# EAGLE design WaterProbe_TopConnector (EAGLE 9.1.3)
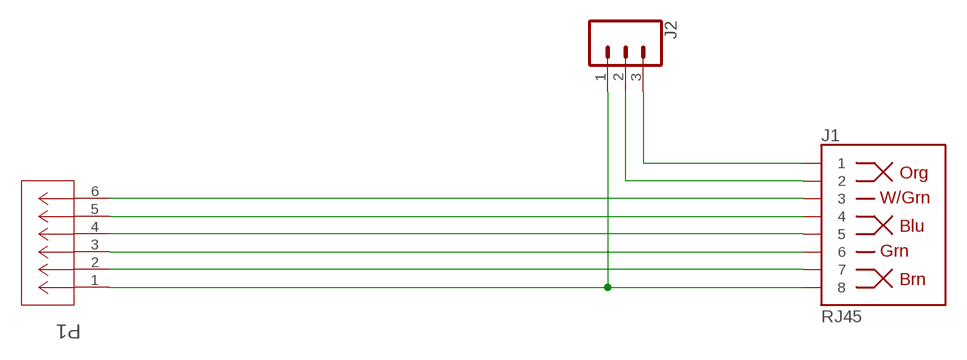
[diagram p0: schematic, sheet 1]

## Parts
J1  RJ45  RJ45-8  [RJ45-8]
J2  CONN_03  [1X03]
P1  6PINJSTS6B-ZR(LF)(SN)  [S6B-ZR]

## Nets
N$1: J1.8 J2.1 P1.1
N$2: J1.7 P1.2
N$3: J1.6 P1.3
N$4: J1.5 P1.4
N$5: J1.4 P1.5
N$6: J1.3 P1.6
N$7: J1.1 J2.3
N$8: J1.2 J2.2

## Library data of the parts
J1 = SparkFun-Connectors:RJ45-8: RJ45 Jack - 8 pin Simple RJ45, 8-pin connection. Commonly used for Cat5, Cat5e, and Cat6 Ethernet cables. Here is the connector we sell at SparkFun: RJ45 8-Pin Connector <https://www.sparkfun.com/products/643> (PRT-00643) Datasheet <https://cdn.sparkfun.com/datasheets/Prototyping/04908.pdf> It is used on this SparkFun product: SparkFun RJ45 Breakout <https://www.sparkfun.com/products/716> (BOB-00716) Note, you may also be interested in the "MAGJACK" version of this. It is basically a RJ45 connector, but also has some status LEDs built into the connector housing. You can check that out in this library at the device named "MAGJACK.dev" and see these products online: RJ45 Ethernet MagJack-Compatible <https://www.sparkfun.com/products/8534> (PRT-08534) SparkFun RJ45 MagJack Breakout <https://www.sparkfun.com/products/13021> (BOB-13021); PROD_ID: CONN-08506; SF_ID: PRT-00643
J2 = SparkFun-Connectors:CONN_03: Multi connection point. Often used as Generic Header-pin footprint for 0.1 inch spaced/style header connections On any of the 0.1 inch spaced packages, you can populate with these: Break Away Headers - Straight <https://www.sparkfun.com/products/116> (PRT-00116) Break Away Male Headers - Right Angle <https://www.sparkfun.com/products/553> (PRT-00553) Female Headers <https://www.sparkfun.com/products/115> (PRT-00115) Break Away Headers - Machine Pin <https://www.sparkfun.com/products/117> (PRT-00117) Break Away Female Headers - Swiss Machine Pin <https://www.sparkfun.com/products/743> (PRT-00743) Stackable Header - 3 Pin (Female, 0.1") <https://www.sparkfun.com/products/13875> (PRT-13875) For SCREWTERMINALS and SPRING TERMINALS visit here: Screw Terimnals on SparkFun.com <https://www.sparkfun.com/search/results?term=Screw+Terminals> (5mm/3.5mm/2.54mm spacing) This device is also useful as a general connection point to wire up your design to another part of your project. Our various solder wires solder well into these plated through hole pads. Hook-Up Wire - Assortment (Stranded, 22 AWG) <https://www.sparkfun.com/products/11375> (PRT-11375) Hook-Up Wire - Assortment (Solid Core, 22 AWG) <https://www.sparkfun.com/products/11367> (PRT-11367) View the entire wire category on our website here <https://www.sparkfun.com/categories/141> Special notes: Molex polarized connector foot print use with SKU : PRT-08232 with associated crimp pins and housings.
P1 = DROP 6pin JST:6PINJSTS6B-ZR(LF)(SN): 6 pin JST Connector Sourced from Digikey; MANUFACTURER_PART_NUMBER: S6BZRLFSN; VENDOR: JST

## Board
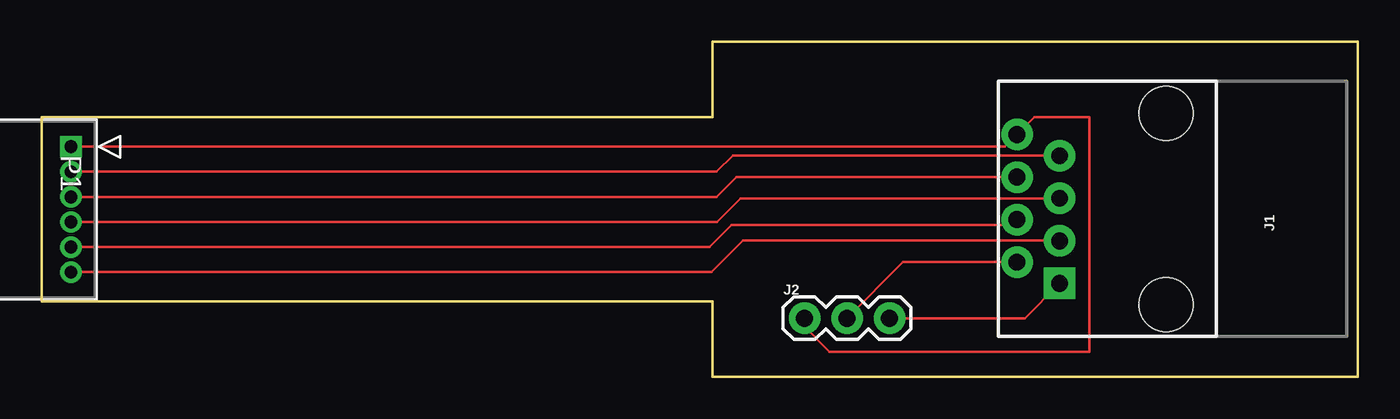
[diagram p1: board, top side]

Size 78.5 x 20 mm. Coordinates in mm from the lower left corner, seen from the top.
Outline: 0,10 0,4.5 40,4.5 40,0 78.5,0 78.5,20 40,20 40,15.5 0,15.5 0,10
Copper layers (1*16): Top 0.035mm / dielectric 1.5mm / Bottom 0.035mm
Design rules "default": minimum track width 6mil, minimum drill 0.35mm, track to track 6mil, track to pad 6mil, pad to pad 6mil, via to via 6mil, smd to smd 6mil, copper to edge 40mil, drill to drill 6mil, minimum pad ring 10mil, minimum via ring 8mil, stop-mask expansion 4mil, vias tented up to drill 0mil, thermal gap 10mil

### Footprints (pad centres in the part's own frame; a part is rotated, then mirrored left to right if it is on the bottom)
RJ45-8 = drill 1 pad 1.88 square: 1 -4.445,6.35 | drill 1 pad 1.88: 2 -3.175,8.89; 3 -1.905,6.35; 4 -0.635,8.89; 5 0.635,6.35; 6 1.905,8.89; 7 3.175,6.35; 8 4.445,8.89 | hole 3.2: -5.715,0; 5.715,0
1X03 = drill 1.016 pad 1.88: 1 0,0; 2 2.54,0; 3 5.08,0
S6B-ZR = drill 0.762 pad 1.27 square: 1 -7.493,0 | drill 0.762 pad 1.27: 2 -5.994,0; 3 -4.496,0; 4 -2.997,0; 5 -1.499,0; 6 0,0

### Placement (x,y rotation side)
J1  67.07,10.02 90 top
J2  45.5,3.5 0 top
P1  1.74,6.25 270 top

### Tracks (layer width: path | path; a pad name or v marks a point on that pad's centre or on a via)
N$1
  Top 0.152: P1.1 57.45,13.74 J1.8 59.21,15.5 62.5,15.5 62.5,1.5 47,1.5 45.25,3.25 J2.1
N$2
  Top 0.152: P1.2 40.24,12.24 41.22,13.22 60.69,13.22 J1.7
N$3
  Top 0.152: P1.3 40.24,10.74 41.43,11.93 J1.6
N$4
  Top 0.152: P1.4 40.28,9.24 41.69,10.66 J1.5
N$5
  Top 0.152: P1.5 39.83,7.75 41.15,9.07 57.86,9.07 J1.4
N$6
  Top 0.152: P1.6 39.94,6.25 41.82,8.13 60.7,8.13 J1.3
N$7
  Top 0.152: J2.3 58.64,3.5 J1.1
N$8
  Top 0.152: J2.2 51.39,6.85 J1.2